# EAGLE schematic main (EAGLE 9.6.2)
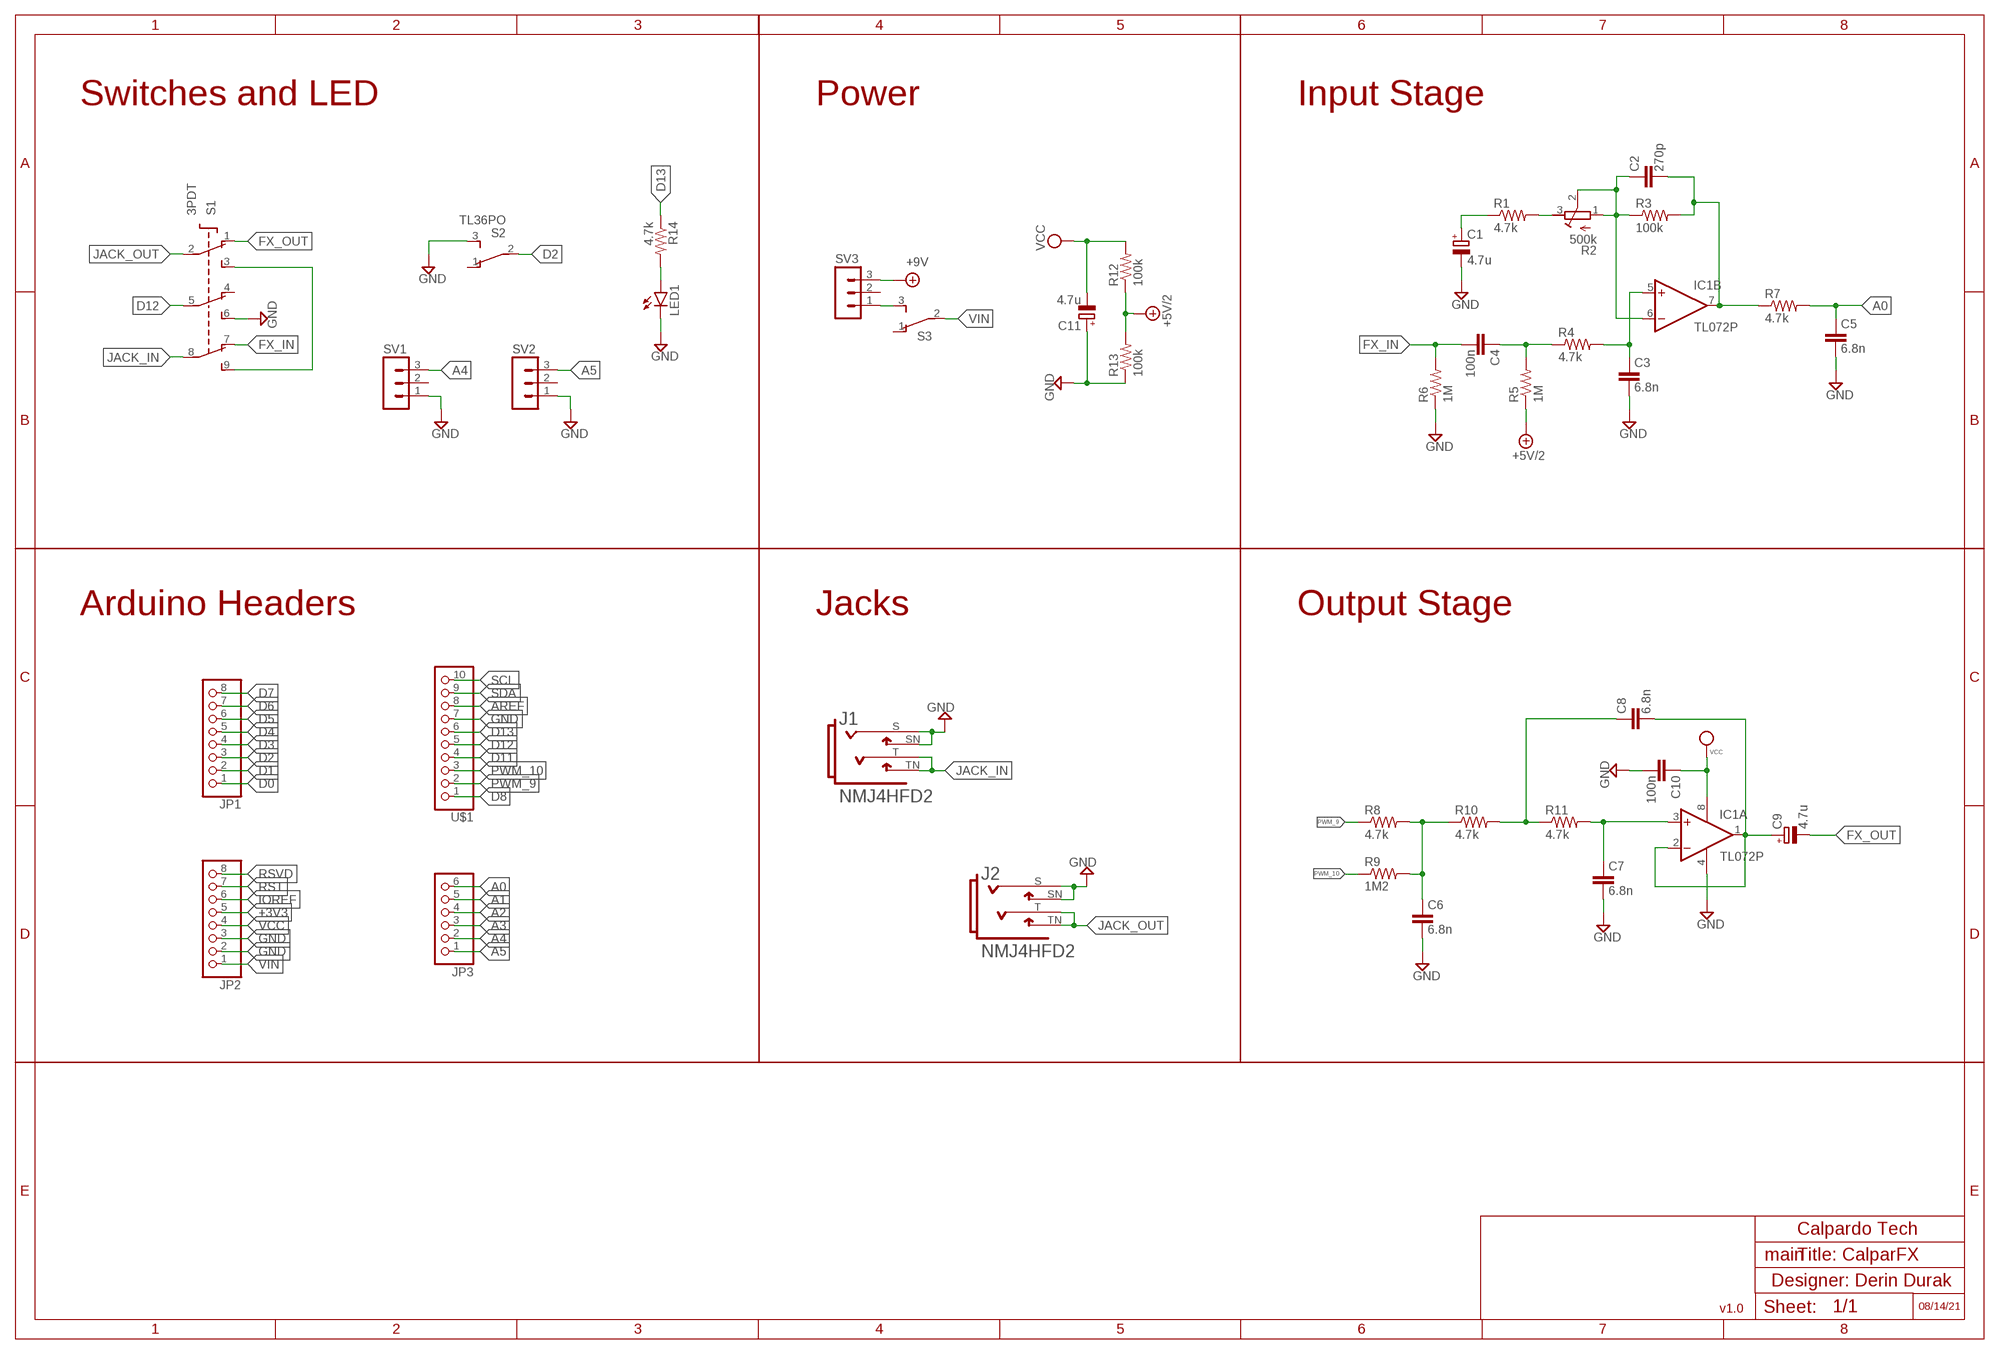
[diagram p0: schematic, sheet 1]

## Parts
C1  4.7u  CPOL-EUE2-5  [E2-5]
C2  270p  C-EU025-024X044  [C025-024X044]
C3  6.8n  C-EU025-024X044  [C025-024X044]
C4  100n  C-EU025-024X044  [C025-024X044]
C5  6.8n  C-EU025-024X044  [C025-024X044]
C6  6.8n  C-EU025-024X044  [C025-024X044]
C7  6.8n  C-EU025-024X044  [C025-024X044]
C8  6.8n  C-EU025-024X044  [C025-024X044]
C9  4.7u  CPOL-EUE2-5  [E2-5]
C10  100n  C-EU025-024X044  [C025-024X044]
C11  4.7u  CPOL-EUE2-5  [E2-5]
IC1  TL072P  [DIL08]
J1  NEUTRIK_NMJ4HFD2NEUTRIK_NMJ4HFD2_0_0  [NEUTRIK_NMJ4HFD2_0]
J2  NEUTRIK_NMJ4HFD2NEUTRIK_NMJ4HFD2_0_0  [NEUTRIK_NMJ4HFD2_0]
JP1  PINHD-1X8BIG  [1X08-BIG]
JP2  PINHD-1X8BIG  [1X08-BIG]
JP3  PINHD-1X6B  [1X06-BIG]
LED1  LED5MM  [LED5MM]
R1  4.7k  R-US_0204/5  [0204/5]
R2  500k  R-TRIMM3296W  [RTRIM3296W]
R3  100k  R-US_0204/5  [0204/5]
R4  4.7k  R-US_0204/5  [0204/5]
R5  1M  R-US_0204/5  [0204/5]
R6  1M  R-US_0204/5  [0204/5]
R7  4.7k  R-US_0204/5  [0204/5]
R8  4.7k  R-US_0204/5  [0204/5]
R9  1M2  R-US_0204/5  [0204/5]
R10  4.7k  R-US_0204/5  [0204/5]
R11  4.7k  R-US_0204/5  [0204/5]
R12  100k  R-US_0204/5  [0204/5]
R13  100k  R-US_0204/5  [0204/5]
R14  4.7k  R-US_0204/5  [0204/5]
S1  3PDT  [3PDT]
S2  TL36PO  [TL3XPO]
S3  TL36PO  [TL3XPO]
SV1  MA03-1  [MA03-1]
SV2  MA03-1  [MA03-1]
SV3  MA03-1  [MA03-1]
U$1  PINHD-1X10  [1X10-BIG]

## Nets
+3V3: JP2.5
+5V/2: R5.1 R12.1 R13.2
+9V: SV3.3
A0: C5.1 JP3.6 R7.2
A1: JP3.5
A2: JP3.4
A3: JP3.3
A4: JP3.2 SV1.3
A5: JP3.1 SV2.3
AREF: U$1.8
D0: JP1.1
D1: JP1.2
D2: JP1.3 S2.2(P)
D3: JP1.4
D4: JP1.5
D5: JP1.6
D6: JP1.7
D7: JP1.8
D8: U$1.1
D11: U$1.4
D12: S1.5(P2) U$1.5
D13: R14.1 U$1.6
FX_IN: C4.2 R6.2 S1.7(O3)
FX_OUT: C9.- S1.1(O1)
GND: C1.- C3.2 C5.2 C6.2 C7.2 C10.2 C11.+ IC1.4(P:V-) J1.S J1.SN J2.S J2.SN JP2.2 JP2.3 LED1.K(C) R6.1 R13.1 S1.6(S2) S2.3(S) SV1.1 SV2.1 U$1.7
IOREF: JP2.6
JACK_IN: J1.T J1.TN S1.8(P3)
JACK_OUT: J2.T J2.TN S1.2(P1)
N$1: C1.+ R1.1
N$2: R1.2 R2.3(E)
N$3: C2.1 IC1.6(B:-IN) R2.1(A) R2.2(S) R3.1
N$4: C3.1 IC1.5(B:+IN) R4.2
N$5: C2.2 IC1.7(B:OUT) R3.2 R7.1
N$6: C4.1 R4.1 R5.2
N$7: C6.1 R8.2 R9.2 R10.1
N$8: C8.1 R10.2 R11.1
N$9: C7.1 IC1.3(A:+IN) R11.2
N$10: C8.2 C9.+ IC1.1(A:OUT) IC1.2(A:-IN)
N$11: LED1.A R14.2
N$12: S3.3(S) SV3.1
N$13: S1.3(S1) S1.9(S3)
PWM_9: R8.1 U$1.2
PWM_10: R9.1 U$1.3
RST: JP2.7
RSVD: JP2.8
SCL: U$1.10
SDA: U$1.9
VCC: C10.1 C11.- IC1.8(P:V+) JP2.4 R12.2
VIN: JP2.1 S3.2(P)
Unconnected: S1.4(O2) S2.1(O) S3.1(O) SV1.2 SV2.2 SV3.2

## Notes on the sheet
- Switches and LED | Power | Input Stage
- Arduino Headers | Jacks | Output Stage
- Calpardo Tech
- Title: CalparFX
- Designer: Derin Durak
- v1.0 | 08/14/21

## Library data of the parts
C1 C9 C11 = rcl:CPOL-EU: POLARIZED CAPACITOR, European symbol; SPICEPREFIX: C
C2-C8 C10 = rcl:C-EU: CAPACITOR, European symbol; SPICEPREFIX: C
IC1 = linear:TL072: OP AMP
J1 J2 = Neutrik - NMJ4HFD2:NEUTRIK_NMJ4HFD2: Conn 1/4" Mono Jack F 3 POS Solder RA Thru-Hole 3 Terminal 1 Port; AUTOMOTIVE: No; CENTROID_NOT_SPECIFIED: No; CONN_ORIENTATION: Horizontal; CONTACT_MATERIAL: Silver; CURRENT_RATING: 0.5A; DATASHEET: https://www.neutrik.com/en/product/nmj4hfd2.pdf; DEVICE_CLASS_L1: Connectors; DEVICE_CLASS_L2: Audio / Video Connectors; DEVICE_CLASS_L3: unset; FOOTPRINT_URL: https://www.neutrik.com/media/8576/download/st-nmj4hfd2.pdf?v=1; FOOTPRINT_VARIANT_NAME_0: Recommended_Land_Pattern; HEIGHT: 15.89mm; IS_FEMALE: yes; LEAD_FREE: Yes; MF: Neutrik; MFG_PACKAGE_IDENT: 0; MFG_PACKAGE_IDENT_DATE: 0; MFG_PACKAGE_IDENT_REV: 0; MOUSER_DESCRIPTION: Phone Audio Connector, Socket, 2, PCB Mount, Metal Body, Silver Plated Contacts; MOUSER_PART_NUMBER: 550-10201; MPN: NMJ4HFD2; NUMBER_OF_CONTACTS: 2; NUM_PINS: 2; OCTOPART_PART_NUMBER: 12cbdbcaa305cd0c; PACKAGE: CONN_MONO_JACK_1/4; PREFIX: J; ROHS: Yes; TEMPERATURE_RANGE_HIGH: +70°C; TEMPERATURE_RANGE_LOW: -25°C; VERIFICATION_VERSION: 0.0.0.3; VOLTAGE_RATING: 50V
JP1 JP2 = adafruit:PINHD-1X8: PIN HEADER
JP3 = adafruit:PINHD-1X6: PIN HEADER
LED1 = led:LED: LED OSRAM: - CHIPLED LG R971, LG N971, LY N971, LG Q971, LY Q971, LO R971, LY R971 LH N974, LH R974 LS Q976, LO Q976, LY Q976 LO Q996 - Hyper CHIPLED LW Q18S LB Q993, LB Q99A, LB R99A - SideLED LS A670, LO A670, LY A670, LG A670, LP A670 LB A673, LV A673, LT A673, LW A673 LH A674 LY A675 LS A676, LA A676, LO A676, LY A676, LW A676 LS A679, LY A679, LG A679 - Hyper Micro SIDELED® LS Y876, LA Y876, LO Y876, LY Y876 LT Y87S - SmartLED LW L88C, LW L88S LB L89C, LB L89S, LG L890 LS L89K, LO L89K, LY L89K LS L896, LA L896, LO L896, LY L896 - TOPLED LS T670, LO T670, LY T670, LG T670, LP T670 LSG T670, LSP T670, LSY T670, LOP T670, LYG T670 LG T671, LOG T671, LSG T671 LB T673, LV T673, LT T673, LW T673 LH T674 LS T676, LA T676, LO T676, LY T676, LB T676, LH T676, LSB T676, LW T676 LB T67C, LV T67C, LT T67C, LS T67K, LO T67K, LY T67K, LW E67C LS E67B, LA E67B, LO E67B, LY E67B, LB E67C, LV E67C, LT E67C LW T67C LS T679, LY T679, LG T679 LS T770, LO T770, LY T770, LG T770, LP T770 LB T773, LV T773, LT T773, LW T773 LH T774 LS E675, LA E675, LY E675, LS T675 LS T776, LA T776, LO T776, LY T776, LB T776 LHGB T686 LT T68C, LB T68C - Hyper Mini TOPLED® LB M676 - Mini TOPLED Santana® LG M470 LS M47K, LO M47K, LY M47K Source: http://www.osram.convergy.de LUXEON: - LUMILED® LXK2-PW12-R00, LXK2-PW12-S00, LXK2-PW14-U00, LXK2-PW14-V00 LXK2-PM12-R00, LXK2-PM12-S00, LXK2-PM14-U00 LXK2-PE12-Q00, LXK2-PE12-R00, LXK2-PE12-S00, LXK2-PE14-T00, LXK2-PE14-U00 LXK2-PB12-K00, LXK2-PB12-L00, LXK2-PB12-M00, LXK2-PB14-N00, LXK2-PB14-P00, LXK2-PB14-Q00 LXK2-PR12-L00, LXK2-PR12-M00, LXK2-PR14-Q00, LXK2-PR14-R00 LXK2-PD12-Q00, LXK2-PD12-R00, LXK2-PD12-S00 LXK2-PH12-R00, LXK2-PH12-S00 LXK2-PL12-P00, LXK2-PL12-Q00, LXK2-PL12-R00 Source: www.luxeon.com KINGBRIGHT: KA-3528ASYC Source: www.kingbright.com
R1 R3-R14 = rcl:R-US_: RESISTOR, American symbol; SPICEPREFIX: R
R2 = rcl:R-TRIMM: Trimm resistor; SPICEMODEL: X; SPICEPREFIXL: POT
S1 = switch:3PDT: 3PDT 9 pin footswitch SF17020F-0302-21R-L Source: 3PDT.jpg
S2 S3 = switch:TL36PO: TINY SWITCH ON - ON Source: http://www2.produktinfo.conrad.com/datenblaetter/700000-724999/705152-da-01-de-Subminiaturschalter_TL_36YO.pdf
SV1-SV3 = con-lstb:MA03-1: PIN HEADER; OC_FARNELL: unknown; OC_NEWARK: unknown
U$1 = adafruit:PINHD-1X10: Pin header 1x10 0.1" spacing With round pins